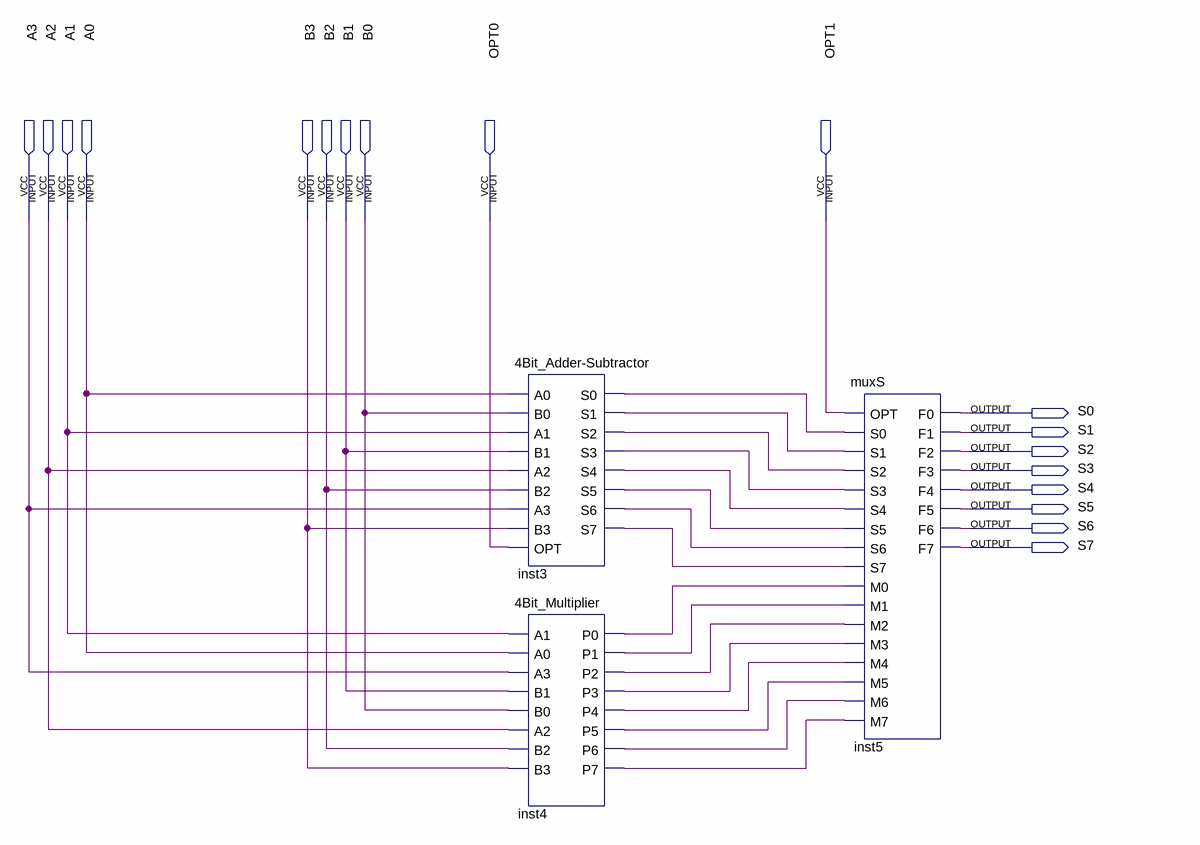
[diagram p0: schematic sheet]
// Quartus schematic ULA.bdf as structural Verilog: 3 symbols, 18 pins
module ULA (
  input  A3,
  input  A2,
  input  A1,
  input  A0,
  input  B3,
  input  B2,
  input  B1,
  input  B0,
  input  OPT0,
  input  OPT1,
  output S0,
  output S1,
  output S2,
  output S3,
  output S4,
  output S5,
  output S6,
  output S7
);

  wire inst3_s0, inst3_s1, inst3_s2, inst3_s3, inst3_s4, inst3_s5, inst3_s6, inst3_s7, inst4_p0, inst4_p1,
       inst4_p2, inst4_p3, inst4_p4, inst4_p5, inst4_p6, inst4_p7;

  \4Bit_Adder-Subtractor  inst3 (
    .A0(A0), .B0(B0), .A1(A1), .B1(B1), .A2(A2), .B2(B2), .A3(A3), .B3(B3), .OPT(OPT0), .S0(inst3_s0),
    .S1(inst3_s1), .S2(inst3_s2), .S3(inst3_s3), .S4(inst3_s4), .S5(inst3_s5), .S6(inst3_s6), .S7(inst3_s7));
  \4Bit_Multiplier  inst4 (
    .A1(A1), .A0(A0), .A3(A3), .B1(B1), .B0(B0), .A2(A2), .B2(B2), .B3(B3), .P0(inst4_p0), .P1(inst4_p1),
    .P2(inst4_p2), .P3(inst4_p3), .P4(inst4_p4), .P5(inst4_p5), .P6(inst4_p6), .P7(inst4_p7));
  muxS inst5 (
    .OPT(OPT1), .S0(inst3_s0), .S1(inst3_s1), .S2(inst3_s2), .S3(inst3_s3), .S4(inst3_s4), .S5(inst3_s5),
    .S6(inst3_s6), .S7(inst3_s7), .M0(inst4_p0), .M1(inst4_p1), .M2(inst4_p2), .M3(inst4_p3), .M4(inst4_p4),
    .M5(inst4_p5), .M6(inst4_p6), .M7(inst4_p7), .F0(S0), .F1(S1), .F2(S2), .F3(S3), .F4(S4), .F5(S5),
    .F6(S6), .F7(S7));
endmodule
